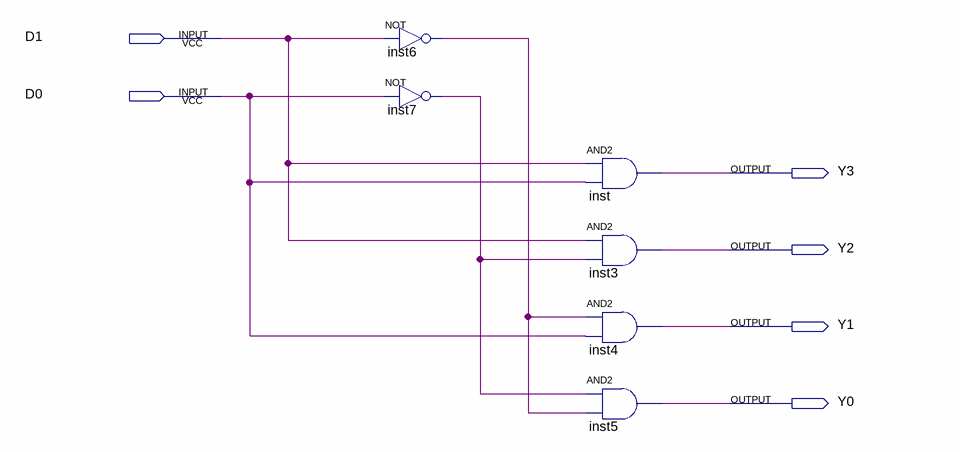
[diagram p0: schematic sheet]
// Quartus schematic 2-4decoder.bdf as structural Verilog: 6 symbols, 6 pins
module \2-4decoder  (
  input  D1,
  input  D0,
  output Y3,
  output Y2,
  output Y1,
  output Y0
);

  wire inst6_out, inst7_out;

  not inst6 (inst6_out, D1);
  not inst7 (inst7_out, D0);
  and inst (Y3, D1, D0);
  and inst3 (Y2, D1, inst7_out);
  and inst4 (Y1, inst6_out, D0);
  and inst5 (Y0, inst7_out, inst6_out);
endmodule
